# Altium schematic sheet STM32-2.SchDoc
size A4; SheetNumber: 2; SheetTotal: 2
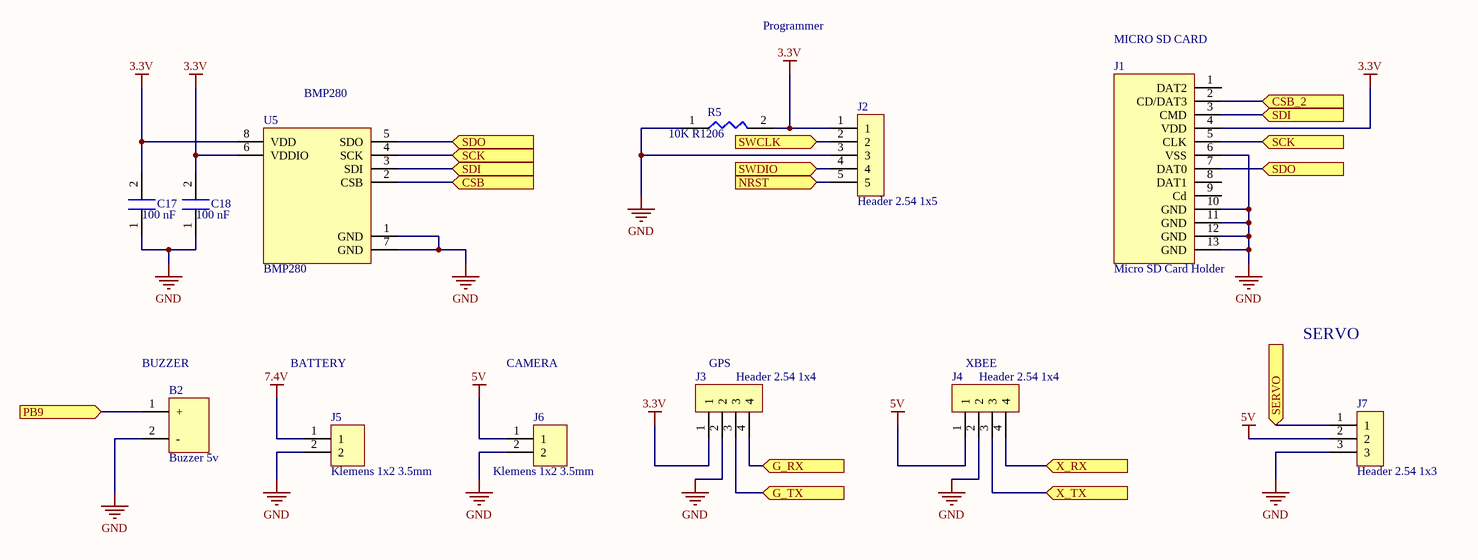
[diagram p0: STM32-2.SchDoc]

## Parts
B2  Buzzer 5v  [Buzzer 5v]
C17  100 nF  [C1206]
C18  100 nF  [C1206]
J1  Micro SD Card Holder  [Micro SD Card Holder]
J2  Header 2.54 1x5  [Header 2.54 1x5]
J3  Header 2.54 1x4  [Header 2.54 1x4]
J4  Header 2.54 1x4  [Header 2.54 1x4]
J5  Klemens 1x2 3.5mm  [Klemens 1x2 - 3.5mm]
J6  Klemens 1x2 3.5mm  [Klemens 1x2 - 3.5mm]
J7  Header 2.54 1x3  [Header 2.54 1x3]
R5  10K R1206  [R1206 Resıstor]
U5  BMP280  [BMP280]

## Ports
CSB (in), CSB_2 (in), G_RX (in), G_TX (in), NRST (in), PB9 (in), SCK (in), SDI (in), SDO (in), SERVO (in), SWCLK (in), SWDIO (in), X_RX (in), X_TX (in)

## Nets
3.3V: C17.2 C18.2 J1.4(VDD) J2.1 J3.1 R5.2 U5.6(VDDIO) U5.8(VDD)
5V: J4.1 J6.1 J7.2
7.4V: J5.1
GND: B2.2(-) C17.1 C18.1 J1.6(VSS) J1.10(GND) J1.11(GND) J1.12(GND) J1.13(GND) J2.3 J3.2 J4.2 J5.2 J6.2 J7.3 R5.1 U5.1(GND) U5.7(GND)
CSB: U5.2(CSB) ; port CSB
CSB_2: J1.2(CD/DAT3) ; port CSB_2
G_RX: J3.4 ; port G_RX
G_TX: J3.3 ; port G_TX
NRST: J2.5 ; port NRST
PB9: B2.1(+) ; port PB9
SCK: J1.5(CLK) U5.4(SCK) ; port SCK
SDI: J1.3(CMD) U5.3(SDI) ; port SDI
SDO: J1.7(DAT0) U5.5(SDO) ; port SDO
SERVO: J7.1 ; port SERVO
SWCLK: J2.2 ; port SWCLK
SWDIO: J2.4 ; port SWDIO
X_RX: J4.4 ; port X_RX
X_TX: J4.3 ; port X_TX

Not connected (* = marked no-connect by the designer): J1 1(DAT2) 8(DAT1) 9(Cd)

## Notes on the sheet
- Programmer
- (near J1) MICRO SD CARD
- (near U5) BMP280
- (near B2) BUZZER
- BATTERY
- CAMERA
- (near J3) GPS
- (near J4) XBEE
- SERVO

## Library data of the parts
U5 = BMP280: BMP280 SENSOR